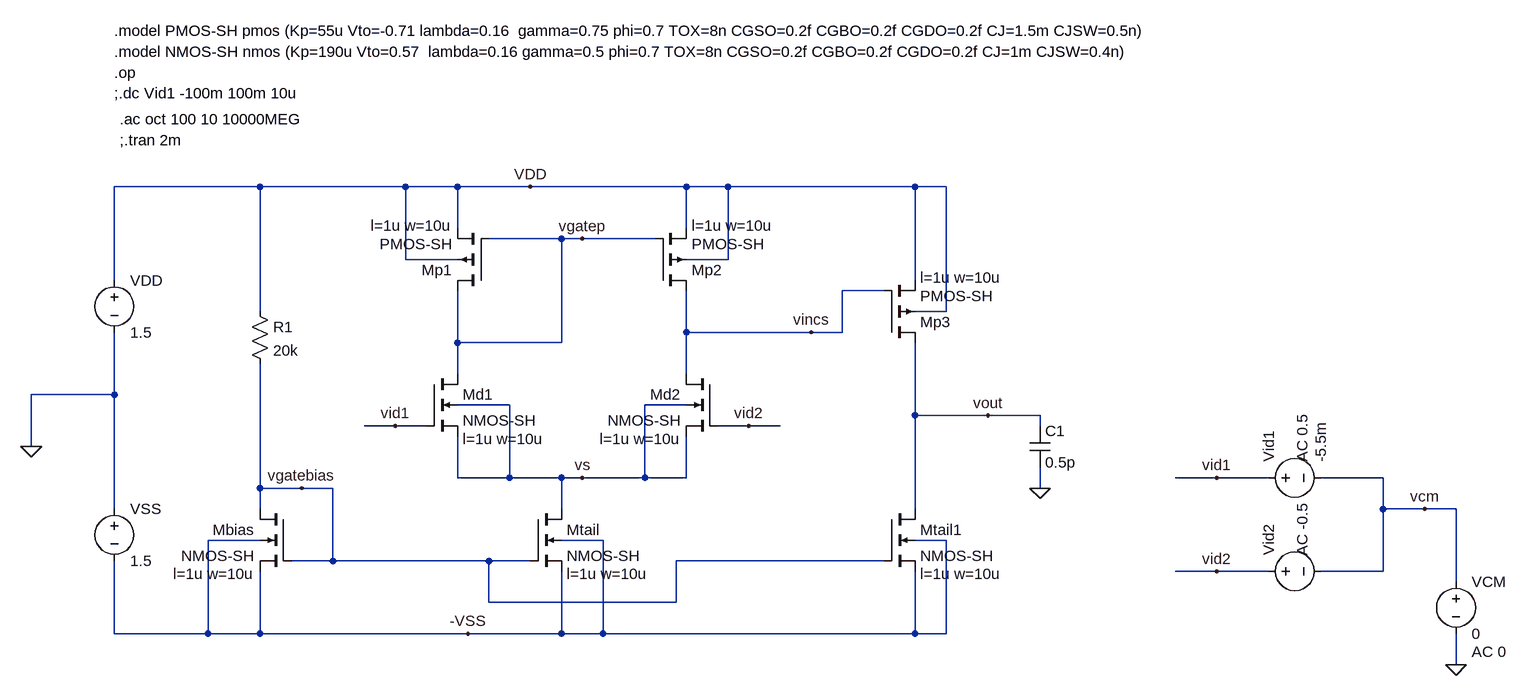
[diagram p0: schematic 2_diff_pair_cs.asc]
2_diff_pair_cs.asc, the LTspice schematic file:
Version 4
SHEET 1 1092 692
WIRE -976 -64 -1200 -64
WIRE -752 -64 -976 -64
WIRE -672 -64 -752 -64
WIRE -560 -64 -672 -64
WIRE -320 -64 -560 -64
WIRE -256 -64 -320 -64
WIRE 32 -64 -256 -64
WIRE 80 -64 32 -64
WIRE -672 0 -672 -64
WIRE -320 0 -320 -64
WIRE -512 16 -624 16
WIRE -480 16 -512 16
WIRE -368 16 -480 16
WIRE -752 48 -752 -64
WIRE -672 48 -752 48
WIRE -256 48 -256 -64
WIRE -256 48 -320 48
WIRE -1200 80 -1200 -64
WIRE 32 80 32 -64
WIRE -16 96 -80 96
WIRE -976 128 -976 -64
WIRE 80 128 80 -64
WIRE 80 128 32 128
WIRE -320 160 -320 96
WIRE -128 160 -320 160
WIRE -80 160 -80 96
WIRE -80 160 -128 160
WIRE -672 176 -672 96
WIRE -512 176 -512 16
WIRE -512 176 -672 176
WIRE -672 224 -672 176
WIRE -320 224 -320 160
WIRE -1200 256 -1200 160
WIRE -1200 256 -1328 256
WIRE -592 272 -672 272
WIRE -320 272 -384 272
WIRE 32 288 32 176
WIRE 144 288 32 288
WIRE 224 288 144 288
WIRE -768 304 -816 304
WIRE -720 304 -768 304
WIRE -224 304 -272 304
WIRE -176 304 -224 304
WIRE 224 304 224 288
WIRE -1328 336 -1328 256
WIRE -672 384 -672 320
WIRE -592 384 -592 272
WIRE -592 384 -672 384
WIRE -512 384 -592 384
WIRE -480 384 -512 384
WIRE -384 384 -384 272
WIRE -384 384 -480 384
WIRE -320 384 -320 320
WIRE -320 384 -384 384
WIRE 496 384 432 384
WIRE 576 384 496 384
WIRE 752 384 656 384
WIRE -976 400 -976 208
WIRE -912 400 -976 400
WIRE -864 400 -912 400
WIRE 224 400 224 368
WIRE -1200 432 -1200 256
WIRE -976 432 -976 400
WIRE -512 432 -512 384
WIRE 32 432 32 288
WIRE 752 432 752 384
WIRE 816 432 752 432
WIRE 864 432 816 432
WIRE -976 480 -1056 480
WIRE -448 480 -512 480
WIRE 80 480 32 480
WIRE -864 512 -864 400
WIRE -864 512 -928 512
WIRE -624 512 -864 512
WIRE -560 512 -624 512
WIRE -16 512 -336 512
WIRE 496 528 432 528
WIRE 576 528 496 528
WIRE 752 528 752 432
WIRE 752 528 656 528
WIRE 864 544 864 432
WIRE -624 576 -624 512
WIRE -336 576 -336 512
WIRE -336 576 -624 576
WIRE -1200 624 -1200 512
WIRE -1056 624 -1056 480
WIRE -1056 624 -1200 624
WIRE -976 624 -976 528
WIRE -976 624 -1056 624
WIRE -656 624 -976 624
WIRE -512 624 -512 528
WIRE -512 624 -656 624
WIRE -448 624 -448 480
WIRE -448 624 -512 624
WIRE 32 624 32 528
WIRE 32 624 -448 624
WIRE 80 624 80 480
WIRE 80 624 32 624
WIRE 864 672 864 624
FLAG -1328 336 0
FLAG 864 672 0
FLAG -768 304 vid1
FLAG -224 304 vid2
FLAG 496 384 vid1
FLAG 496 528 vid2
FLAG 816 432 vcm
FLAG 224 400 0
FLAG -480 384 vs
FLAG -912 400 vgatebias
FLAG -480 16 vgatep
FLAG -560 -64 VDD
FLAG -656 624 -VSS
FLAG 144 288 vout
FLAG -128 160 vincs
DATAFLAG 32 288 ""
SYMBOL nmos4 -720 224 R0
WINDOW 123 56 100 Left 2
SYMATTR Value2 l=1u w=10u
SYMATTR InstName Md1
SYMATTR Value NMOS-SH
SYMBOL voltage -1200 416 R0
WINDOW 123 0 0 Left 2
WINDOW 39 0 0 Left 2
SYMATTR InstName VSS
SYMATTR Value 1.5
SYMBOL nmos4 -272 224 M0
WINDOW 123 56 100 Left 2
SYMATTR Value2 l=1u w=10u
SYMATTR InstName Md2
SYMATTR Value NMOS-SH
SYMBOL nmos4 -560 432 R0
WINDOW 123 56 100 Left 2
SYMATTR Value2 l=1u w=10u
SYMATTR InstName Mtail
SYMATTR Value NMOS-SH
SYMBOL pmos4 -368 96 M180
WINDOW 123 56 100 Left 2
SYMATTR Value2 l=1u w=10u
SYMATTR InstName Mp2
SYMATTR Value PMOS-SH
SYMBOL pmos4 -624 96 R180
WINDOW 123 56 100 Left 2
SYMATTR Value2 l=1u w=10u
SYMATTR InstName Mp1
SYMATTR Value PMOS-SH
SYMBOL nmos4 -928 432 M0
WINDOW 123 56 100 Left 2
SYMATTR Value2 l=1u w=10u
SYMATTR InstName Mbias
SYMATTR Value NMOS-SH
SYMBOL res -992 112 R0
SYMATTR InstName R1
SYMATTR Value 20k
SYMBOL voltage -1200 64 R0
WINDOW 123 0 0 Left 2
WINDOW 39 0 0 Left 2
SYMATTR InstName VDD
SYMATTR Value 1.5
SYMBOL voltage 864 528 R0
WINDOW 123 24 124 Left 2
WINDOW 39 0 0 Left 2
SYMATTR Value2 AC 0
SYMATTR InstName VCM
SYMATTR Value 0
SYMBOL voltage 560 384 R270
WINDOW 123 24 68 Left 2
WINDOW 39 0 0 Left 2
SYMATTR Value2 AC 0.5
SYMATTR InstName Vid1
SYMATTR Value -5.5m
SYMBOL voltage 560 528 R270
WINDOW 123 24 68 Left 2
WINDOW 39 0 0 Left 2
SYMATTR Value2 AC -0.5
SYMATTR InstName Vid2
SYMATTR Value ""
SYMBOL cap 208 304 R0
SYMATTR InstName C1
SYMATTR Value 0.5p
SYMBOL pmos4 -16 176 M180
WINDOW 123 56 100 Left 2
SYMATTR Value2 l=1u w=10u
SYMATTR InstName Mp3
SYMATTR Value PMOS-SH
SYMBOL nmos4 -16 432 R0
WINDOW 123 56 100 Left 2
SYMATTR Value2 l=1u w=10u
SYMATTR InstName Mtail1
SYMATTR Value NMOS-SH
TEXT -1200 -272 Left 2 !.model NMOS-SH nmos (Kp=190u Vto=0.57  lambda=0.16 gamma=0.5 phi=0.7 TOX=8n CGSO=0.2f CGBO=0.2f CGDO=0.2f CJ=1m CJSW=0.4n)
TEXT -1200 -208 Left 2 !;.dc Vid1 -100m 100m 10u
TEXT -1200 -240 Left 2 !.op
TEXT -1192 -168 Left 2 !.ac oct 100 10 10000MEG
TEXT -1200 -304 Left 2 !.model PMOS-SH pmos (Kp=55u Vto=-0.71 lambda=0.16  gamma=0.75 phi=0.7 TOX=8n CGSO=0.2f CGBO=0.2f CGDO=0.2f CJ=1.5m CJSW=0.5n)
TEXT -1192 -136 Left 2 !;.tran 2m

The netlist it stands for:
* 2_diff_pair_cs.asc
Md1 vgatep vid1 vs vs NMOS-SH l=1u w=10u
VSS 0 -VSS 1.5
Md2 vincs vid2 vs vs NMOS-SH l=1u w=10u
Mtail vs vgatebias -VSS -VSS NMOS-SH l=1u w=10u
Mp2 vincs vgatep VDD VDD PMOS-SH l=1u w=10u
Mp1 vgatep vgatep VDD VDD PMOS-SH l=1u w=10u
Mbias vgatebias vgatebias -VSS -VSS NMOS-SH l=1u w=10u
R1 VDD vgatebias 20k
VDD VDD 0 1.5
VCM vcm 0 0 AC 0
Vid1 vid1 vcm -5.5m AC 0.5
Vid2 vid2 vcm AC -0.5
C1 vout 0 0.5p
Mp3 vout vincs VDD VDD PMOS-SH l=1u w=10u
Mtail1 vout vgatebias -VSS -VSS NMOS-SH l=1u w=10u
.model NMOS NMOS
.model PMOS PMOS
.lib standard.mos
.model NMOS-SH nmos (Kp=190u Vto=0.57  lambda=0.16 gamma=0.5 phi=0.7 TOX=8n CGSO=0.2f CGBO=0.2f CGDO=0.2f CJ=1m CJSW=0.4n)
;.dc Vid1 -100m 100m 10u
.op
.ac oct 100 10 10000MEG
.model PMOS-SH pmos (Kp=55u Vto=-0.71 lambda=0.16  gamma=0.75 phi=0.7 TOX=8n CGSO=0.2f CGBO=0.2f CGDO=0.2f CJ=1.5m CJSW=0.5n)
;.tran 2m
.backanno
.end